# EAGLE design pmg001 (EAGLE 9.6.2)
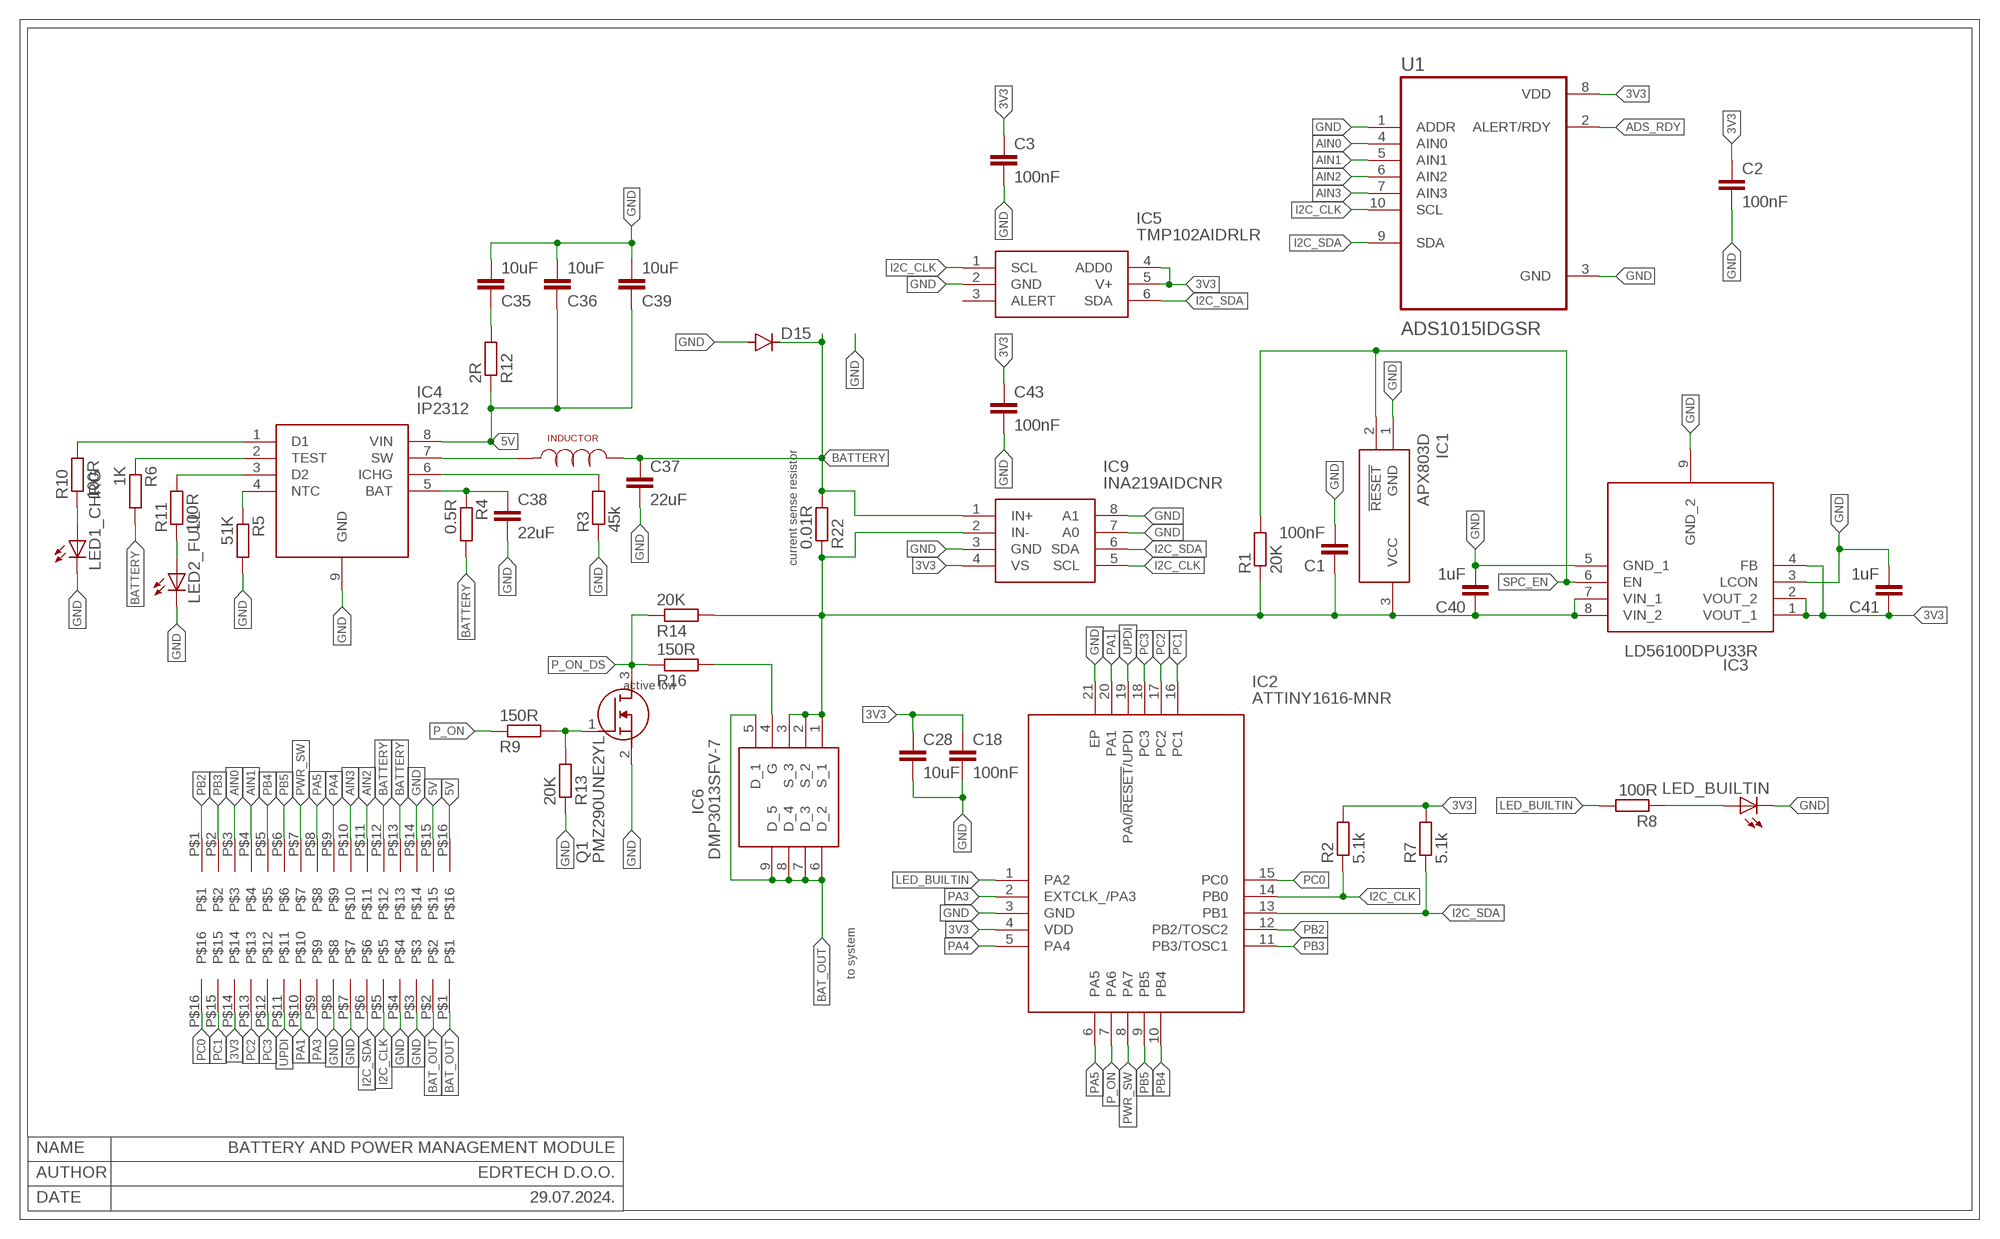
[diagram p0: schematic, sheet 1]

## Parts
C1  100nF  C-EUC0402  [C0402]
C2  100nF  C-EUC0402  [C0402]
C3  100nF  C-EUC0402  [C0402]
C18  100nF  C-EUC0402  [C0402]
C28  10uF  C-EUC0402  [C0402]
C35  10uF  C-EUC0603  [C0603]
C36  10uF  C-EUC0603  [C0603]
C37  22uF  C-EUC0603  [C0603]
C38  22uF  C-EUC0603  [C0603]
C39  10uF  C-EUC0603  [C0603]
C40  1uF  C-EUC0402  [C0402]
C41  1uF  C-EUC0402  [C0402]
C43  100nF  C-EUC0402  [C0402]
D15  DIODE-SOD523  [SOD523]
IC1  APX803D-29SAG-7  [SOT96P240X110-3N]
IC2  ATTINY1616-MNR  [QFN40P300X300X90-21N]
IC3  LD56100DPU30R  [SON40P120X160X50-9N]
IC4  IP2312  [SOIC127P600X165-9N]
IC5  TMP102AIDRLR  [SOTFL50P160X60-6N]
IC6  DMP3013SFV-7  [DMP3036SFV7]
IC9  INA219AIDCNR  [SOP65P280X145-8N]
LED1_CHRG  LEDCHIPLED_0603  [CHIPLED_0603]
LED2_FULL  LEDCHIPLED_0603  [CHIPLED_0603]
LED_BUILTIN  LEDCHIPLED_0603  [CHIPLED_0603]
Q1  PMZ290UNE2YL  [PMZ290UNE2YL]
R1  20K  R-EU_R0402  [R0402]
R2  5.1k  R-EU_R0402  [R0402]
R3  45k  R-EU_R0402  [R0402]
R4  0.5R  R-EU_R0402  [R0402]
R5  51K  R-EU_R0402  [R0402]
R6  1K  R-EU_R0402  [R0402]
R7  5.1k  R-EU_R0402  [R0402]
R8  100R  R-EU_R0402  [R0402]
R9  150R  R-EU_R0402  [R0402]
R10  100R  R-EU_R0402  [R0402]
R11  100R  R-EU_R0402  [R0402]
R12  2R  R-EU_R0402  [R0402]
R13  20K  R-EU_R0402  [R0402]
R14  20K  R-EU_R0402  [R0402]
R16  150R  R-EU_R0402  [R0402]
R22  0.01R  R-EU_R2512  [R2512]
U1  ADS1015IDGSR  [SOP50P490X110-10N]
U$1  1.27_MALE_16P_HEADER  [1.27_MALE_16P_HEADER]
U$2  1.27_MALE_16P_HEADER  [1.27_MALE_16P_HEADER]
U$91  1uH  NRS5040T3R3NMGJ  [NRS5040T3R3NMGJ]

## Nets
3V3: C2.1 C3.1 C18.1 C28.1 C41.1 C43.1 IC2.4(VDD) IC3.1(VOUT_1) IC3.2(VOUT_2) IC3.4(FB) IC5.4(ADD0) IC5.5(V+) IC9.4(VS) R2.2 R7.2 U1.8(VDD) U$2.P$14
5V: C36.1 C39.1 IC4.8(VIN) R12.1 U$1.P$15 U$1.P$16
ADS_RDY: U1.2(ALERT/RDY)
AIN0: U1.4(AIN0) U$1.P$3
AIN1: U1.5(AIN1) U$1.P$4
AIN2: U1.6(AIN2) U$1.P$11
AIN3: U1.7(AIN3) U$1.P$10
BAT_OUT: IC6.5(D_1) IC6.6(D_2) IC6.7(D_3) IC6.8(D_4) IC6.9(D_5) U$2.P$1 U$2.P$2
BATTERY: C37.1 D15.C IC9.1(IN+) R4.2 R6.2 R22.2 U$1.P$12 U$1.P$13 U$91.P$1
BTAP: C1.1 C40.1 IC1.3(VCC) IC3.7(VIN_1) IC3.8(VIN_2) IC6.1(S_1) IC6.2(S_2) IC6.3(S_3) IC9.2(IN-) R1.1 R14.2 R22.1
GND: C1.2 C2.2 C3.2 C18.2 C28.2 C35.2 C36.2 C37.2 C38.2 C39.2 C40.2 C41.2 C43.2 D15.A IC1.1(GND) IC2.3(GND) IC2.21(EP) IC3.3(LCON) IC3.5(GND_1) IC3.9(GND_2) IC4.9(GND) IC5.2(GND) IC9.3(GND) IC9.7(A0) IC9.8(A1) LED1_CHRG.C LED2_FULL.C LED_BUILTIN.C Q1.2(S) R3.1 R5.2 R13.1 U1.1(ADDR) U1.3(GND) U$1.P$14 U$2.P$3 U$2.P$4 U$2.P$7 U$2.P$8
I2C_CLK: IC2.14(PB0) IC5.1(SCL) IC9.5(SCL) R2.1 U1.10(SCL) U$2.P$5
I2C_SDA: IC2.13(PB1) IC5.6(SDA) IC9.6(SDA) R7.1 U1.9(SDA) U$2.P$6
LED_BUILTIN: IC2.1(PA2) R8.2
N$1: Q1.1(G) R9.2 R13.2
N$2: LED_BUILTIN.A R8.1
N$6: IC6.4(G) R16.2
N$8: IC4.6(ICHG) R3.2
N$10: C35.1 R12.2
N$12: LED1_CHRG.A R10.1
N$13: LED2_FULL.A R11.1
N$14: IC4.4(NTC) R5.1
N$15: IC4.2(TEST) R6.1
N$16: IC4.1(D1) R10.2
N$18: IC4.3(D2) R11.2
N$21: C38.1 IC4.5(BAT) R4.1
N$22: IC4.7(SW) U$91.P$2
P_ON: IC2.7(PA6) R9.1
P_ON_DS: Q1.3(D) R14.1 R16.1
PA1: IC2.20(PA1) U$2.P$10
PA3: IC2.2(EXTCLK_/PA3) U$2.P$9
PA4: IC2.5(PA4) U$1.P$9
PA5: IC2.6(PA5) U$1.P$8
PB2: IC2.12(PB2/TOSC2) U$1.P$1
PB3: IC2.11(PB3/TOSC1) U$1.P$2
PB4: IC2.10(PB4) U$1.P$5
PB5: IC2.9(PB5) U$1.P$6
PC0: IC2.15(PC0) U$2.P$16
PC1: IC2.16(PC1) U$2.P$15
PC2: IC2.17(PC2) U$2.P$13
PC3: IC2.18(PC3) U$2.P$12
PWR_SW: IC2.8(PA7) U$1.P$7
SPC_EN: IC1.2(!RESET) IC3.6(EN) R1.2
UPDI: IC2.19(PA0/!RESET!/UPDI) U$2.P$11
Unconnected: IC5.3(ALERT)

## Notes on the sheet
- APX803D
- current sense resistor
- LD56100DPU33R
- active low
- to system
- NAME | BATTERY AND POWER MANAGEMENT MODULE
- AUTHOR | EDRTECH D.O.O.
- DATE | 29.07.2024.

## Library data of the parts
C1-C3 C18 C28 C35-C41 C43 = rcl:C-EU: CAPACITOR, European symbol; SPICEPREFIX: C
D15 = diode:DIODE-: DIODE
IC1 = edrtech_lib:APX803D-29SAG-7: Supervisory Circuits 3-Pin MPU Reset 30uA 2.5V, 3V, 3.3V, 5V Source: Datasheet <https://www.diodes.com/assets/Datasheets/products_inactive_data/APX803-D-Not-Recommended.pdf>; ARROW_PART_NUMBER: APX803D-29SAG-7; ARROW_PRICE-STOCK: https://www.arrow.com/en/products/apx803d-29sag-7/diodes-incorporated; DESCRIPTION: Supervisory Circuits 3-Pin MPU Reset 30uA 2.5V, 3V, 3.3V, 5V; HEIGHT: 1.1mm; MANUFACTURER_NAME: Diodes Incorporated; MANUFACTURER_PART_NUMBER: APX803D-29SAG-7; MOUSER_PART_NUMBER: 621-APX803D-29SAG-7; MOUSER_PRICE-STOCK: http://www.mouser.com/Search/ProductDetail.aspx?qs=j2HO5yQWbRfEn7scG%2fxEEg%3d%3d
IC2 = edrtech_lib:ATTINY1616-MNR: Microchip ATTINY1616-MNR, 8bit AVR Microcontroller, 20MHz, 16 kB Flash, 20-Pin VQFN Source: Datasheet <https://datasheet.datasheetarchive.com/originals/distributors/DKDS41/DSANUWW0026757.pdf>; ARROW_PART_NUMBER: ATTINY1616-MNR; ARROW_PRICE-STOCK: https://www.arrow.com/en/products/attiny1616-mnr/microchip-technology?region=nac; DESCRIPTION: Microchip ATTINY1616-MNR, 8bit AVR Microcontroller, 20MHz, 16 kB Flash, 20-Pin VQFN; HEIGHT: 0.9mm; MANUFACTURER_NAME: Microchip; MANUFACTURER_PART_NUMBER: ATTINY1616-MNR; MOUSER_PART_NUMBER: 556-ATTINY1616MNR; MOUSER_PRICE-STOCK: https://www.mouser.co.uk/ProductDetail/Microchip-Technology/ATTINY1616-MNR?qs=HXFqYaX1Q2yKNpuKQU9qww%3D%3D
IC3 = edrtech_lib:LD56100DPU30R: LDO Voltage Regulators POWER MANAGEMENT Source: Datasheet <https://componentsearchengine.com/Datasheets/1/LD56100DPU30R.pdf>; ARROW_PART_NUMBER: LD56100DPU30R; ARROW_PRICE-STOCK: https://www.arrow.com/en/products/ld56100dpu30r/stmicroelectronics?region=nac; DESCRIPTION: LDO Voltage Regulators POWER MANAGEMENT; HEIGHT: 0.5mm; MANUFACTURER_NAME: STMicroelectronics; MANUFACTURER_PART_NUMBER: LD56100DPU30R; MOUSER_PART_NUMBER: 511-LD56100DPU30R; MOUSER_PRICE-STOCK: https://www.mouser.co.uk/ProductDetail/STMicroelectronics/LD56100DPU30R?qs=rrS6PyfT74cpfJYuxhTQmg%3D%3D
IC4 = IP2312:IP2312: ESOP-8L DC-DC Converters RoHS Source: Datasheet <http://www.injoinic.com/wwwroot/uploads/files/20230913/623558e526750db62e25e32800f94a6b.pdf>; DESCRIPTION: ESOP-8L DC-DC Converters RoHS; HEIGHT: 1.65mm; MANUFACTURER_NAME: INJOINIC; MANUFACTURER_PART_NUMBER: IP2312
IC5 = edrtech_lib:TMP102AIDRLR: 1.4V-Capable Temperature Sensor with I2C/SMBus Interface and Alert Function in SOT-563 Source: Datasheet <http://www.ti.com/lit/gpn/tmp102>; ARROW_PART_NUMBER: TMP102AIDRLR; ARROW_PRICE-STOCK: https://www.arrow.com/en/products/tmp102aidrlr/texas-instruments?region=nac; DESCRIPTION: 1.4V-Capable Temperature Sensor with I2C/SMBus Interface and Alert Function in SOT-563; HEIGHT: 0.6mm; MANUFACTURER_NAME: Texas Instruments; MANUFACTURER_PART_NUMBER: TMP102AIDRLR; MOUSER_PART_NUMBER: 595-TMP102AIDRLR; MOUSER_PRICE-STOCK: https://www.mouser.co.uk/ProductDetail/Texas-Instruments/TMP102AIDRLR?qs=SUwrw6jWmlKK8eMrKfK4LA%3D%3D
IC6 = edrtech_lib:DMP3013SFV-7: Trans MOSFET P-CH 30V 12A 8-Pin PowerDI EP T/R Source: Datasheet <https://www.diodes.com//assets/Datasheets/DMP3013SFV.pdf>; ARROW_PART_NUMBER: DMP3013SFV-7; ARROW_PRICE-STOCK: https://www.arrow.com/en/products/dmp3013sfv-7/diodes-incorporated?region=nac; DESCRIPTION: Trans MOSFET P-CH 30V 12A 8-Pin PowerDI EP T/R; HEIGHT: mm; MANUFACTURER_NAME: Diodes Incorporated; MANUFACTURER_PART_NUMBER: DMP3013SFV-7; MOUSER_PART_NUMBER: 621-DMP3013SFV-7; MOUSER_PRICE-STOCK: https://www.mouser.co.uk/ProductDetail/Diodes-Incorporated/DMP3013SFV-7?qs=W0yvOO0ixfH1hnmiAtL1VQ%3D%3D
IC9 = edrtech_lib:INA219AIDCNR: TEXAS INSTRUMENTS - INA219AIDCNR - CURRENT/POWER MONITOR, SOT-23-8, FULL REEL Source: Datasheet <https://componentsearchengine.com/Datasheets/2/INA219AIDCNR.pdf>; ARROW_PART_NUMBER: INA219AIDCNR; ARROW_PRICE-STOCK: null?region=nac; DESCRIPTION: TEXAS INSTRUMENTS - INA219AIDCNR - CURRENT/POWER MONITOR, SOT-23-8, FULL REEL; HEIGHT: 1.45mm; MANUFACTURER_NAME: Texas Instruments; MANUFACTURER_PART_NUMBER: INA219AIDCNR; MOUSER_PART_NUMBER: 595-INA219AIDCNR; MOUSER_PRICE-STOCK: https://www.mouser.co.uk/ProductDetail/Texas-Instruments/INA219AIDCNR?qs=NNt36bEIu0tiHc879dL2eg%3D%3D
LED1_CHRG LED2_FULL LED_BUILTIN = adafruit:LED: LED OSRAM: - CHIPLED LG R971, LG N971, LY N971, LG Q971, LY Q971, LO R971, LY R971 LH N974, LH R974 LS Q976, LO Q976, LY Q976 LO Q996 - Hyper CHIPLED LW Q18S LB Q993, LB Q99A, LB R99A - SideLED LS A670, LO A670, LY A670, LG A670, LP A670 LB A673, LV A673, LT A673, LW A673 LH A674 LY A675 LS A676, LA A676, LO A676, LY A676, LW A676 LS A679, LY A679, LG A679 - Hyper Micro SIDELED® LS Y876, LA Y876, LO Y876, LY Y876 LT Y87S - SmartLED LW L88C, LW L88S LB L89C, LB L89S, LG L890 LS L89K, LO L89K, LY L89K LS L896, LA L896, LO L896, LY L896 - TOPLED LS T670, LO T670, LY T670, LG T670, LP T670 LSG T670, LSP T670, LSY T670, LOP T670, LYG T670 LG T671, LOG T671, LSG T671 LB T673, LV T673, LT T673, LW T673 LH T674 LS T676, LA T676, LO T676, LY T676, LB T676, LH T676, LSB T676, LW T676 LB T67C, LV T67C, LT T67C, LS T67K, LO T67K, LY T67K, LW E67C LS E67B, LA E67B, LO E67B, LY E67B, LB E67C, LV E67C, LT E67C LW T67C LS T679, LY T679, LG T679 LS T770, LO T770, LY T770, LG T770, LP T770 LB T773, LV T773, LT T773, LW T773 LH T774 LS E675, LA E675, LY E675, LS T675 LS T776, LA T776, LO T776, LY T776, LB T776 LHGB T686 LT T68C, LB T68C - Hyper Mini TOPLED® LB M676 - Mini TOPLED Santana® LG M470 LS M47K, LO M47K, LY M47K Source: http://www.osram.convergy.de/
Q1 = edrtech_lib:PMZ290UNE2YL: NEXPERIA - PMZ290UNE2YL - MOSFET, N-CH, 20V, 1.2A, SOT883-3 Source: Datasheet <https://assets.nexperia.com/documents/data-sheet/PMZ290UNE2.pdf>; ARROW_PART_NUMBER: PMZ290UNE2YL; ARROW_PRICE-STOCK: https://www.arrow.com/en/products/pmz290une2yl/nexperia?region=nac; DESCRIPTION: NEXPERIA - PMZ290UNE2YL - MOSFET, N-CH, 20V, 1.2A, SOT883-3; HEIGHT: 0.5mm; MANUFACTURER_NAME: Nexperia; MANUFACTURER_PART_NUMBER: PMZ290UNE2YL; MOUSER_PART_NUMBER: 771-PMZ290UNE2YL; MOUSER_PRICE-STOCK: https://www.mouser.co.uk/ProductDetail/Nexperia/PMZ290UNE2YL?qs=d7b8vw%252BBfo36oSq9BwEp0w%3D%3D
R1-R14 R16 R22 = rcl:R-EU_: RESISTOR, European symbol; SPICEPREFIX: R
U1 = edrtech_lib:ADS1015IDGSR: Check availability <https://pricing.snapeda.com/parts/ADS1015IDGSR/Texas%20Instruments/view-part?ref=eda>; AVAILABILITY: In Stock; CHECK_PRICES: https://www.snapeda.com/parts/ADS1015IDGSR/Texas+Instruments/view-part/?ref=eda; DESCRIPTION: 12-bit, 3.3-kSPS, 4-channel, delta-sigma ADC with PGA, oscillator, VREF, comparator and I2C; MF: Texas Instruments; MP: ADS1015IDGSR; PACKAGE: VSSOP-10 Texas Instruments; PRICE: None; PURCHASE-URL: https://www.snapeda.com/api/url_track_click_mouser/?unipart_id=449361&manufacturer=Texas Instruments&part_name=ADS1015IDGSR&search_term=ads1015; SNAPEDA_LINK: https://www.snapeda.com/parts/ADS1015IDGSR/Texas+Instruments/view-part/?ref=snap
U$1 U$2 = edrtech_lib:1.27_MALE_16P_HEADER
U$91 = edrtech_lib:NRS5040T3R3NMGJ

## Net classes
0 default: width 0.203 mm

## Board
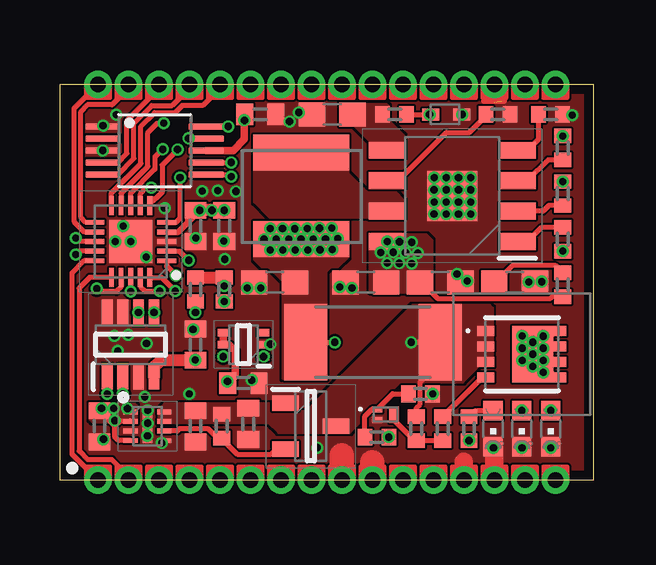
[diagram p1: board, top side]
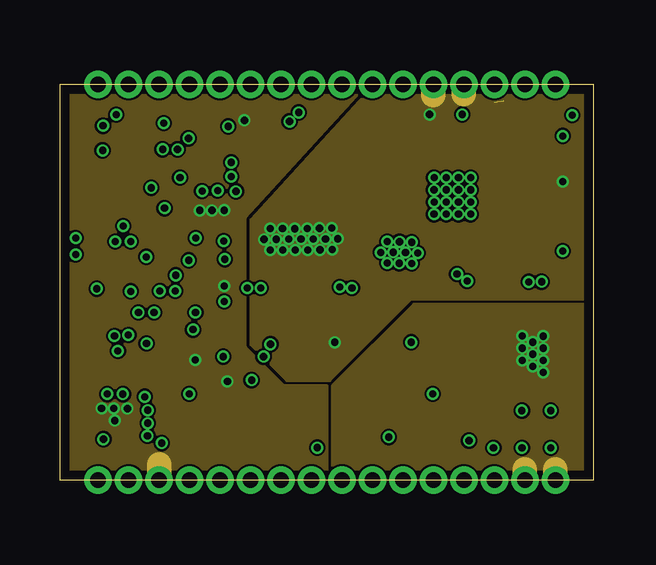
[diagram p2: board, inner layer Route2]
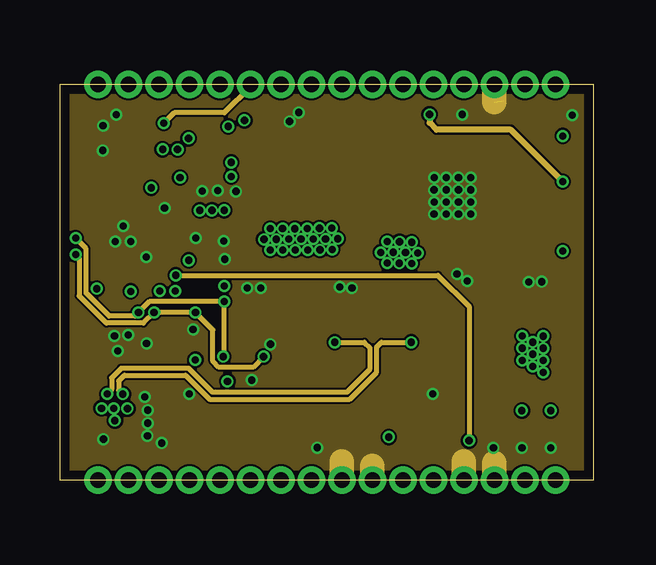
[diagram p3: board, inner layer Route3]
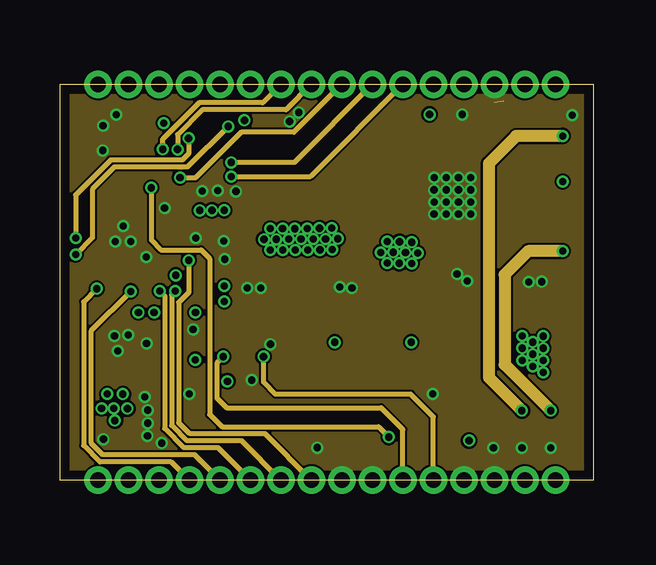
[diagram p4: board, inner layer Route14]
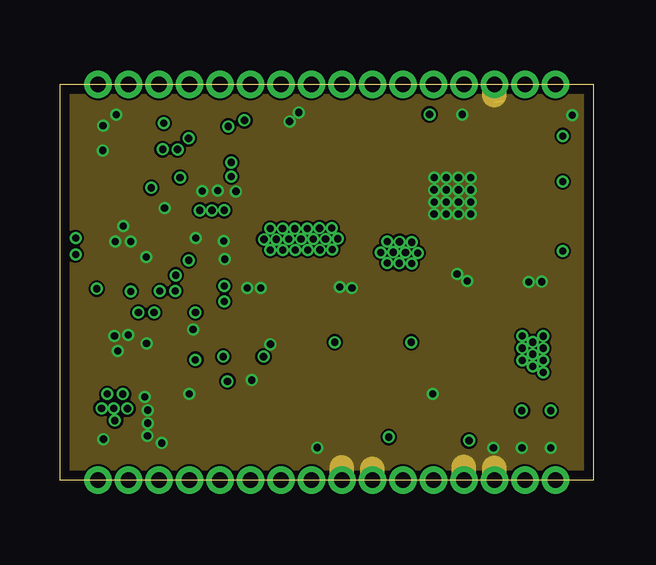
[diagram p5: board, inner layer Route15]
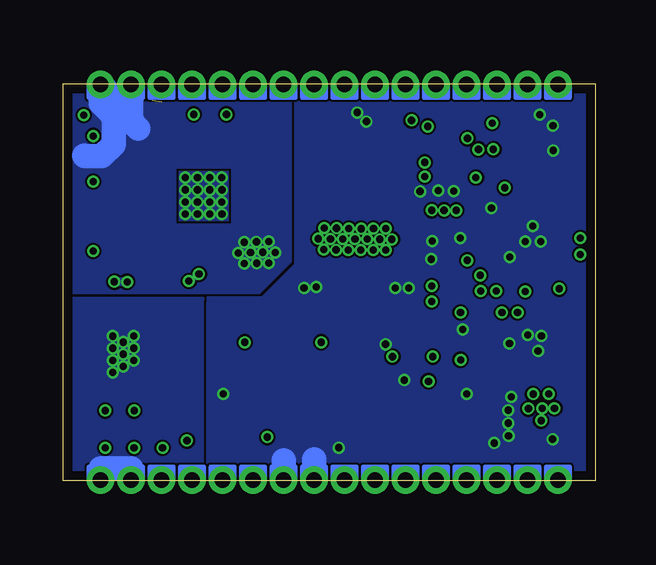
[diagram p6: board, bottom side, seen from below]

Size 22.23 x 16.51 mm. Coordinates in mm from the lower left corner, seen from the top.
Outline: 0,0 0,16.51 22.23,16.51 22.23,0 0,0
Copper layers (1+2*3+14*15+16): Top 0.035mm / dielectric 0.0994mm / Route2 0.0152mm / dielectric 0.55mm / Route3 0.0152mm / dielectric 0.1088mm / Route14 0.0152mm / dielectric 0.55mm / Route15 0.0152mm / dielectric 0.0994mm / Bottom 0.035mm
Design rules "jlcpcb-6layers_edrtech_minspec *": minimum track width 3.5mil, minimum drill 0.3mm, track to track 3.5mil, track to pad 3.5mil, pad to pad 3.5mil, via to via 3.5mil, smd to smd 0mil, copper to edge 0.4mm, drill to drill 6mil, minimum pad ring 0.25mm, minimum via ring 0.1mm, stop-mask expansion 2mil, vias tented up to drill 25mil, thermal gap 5mil

### Footprints (pad centres in the part's own frame; a part is rotated, then mirrored left to right if it is on the bottom)
C0402 = smd 0.7 x 0.9: 1 -0.65,0; 2 0.65,0
C0603 = smd 1.1 x 1: 1 -0.85,0; 2 0.85,0
SOD523 = smd 0.7 x 0.5: A 0.7,0; C -0.6,0
SOT96P240X110-3N = smd 1.1 x 0.65: 1 -1.05,0.96; 2 -1.05,-0.96; 3 1.05,0
QFN40P300X300X90-21N = smd 0.8 x 0.2: 1 -1.5,0.8; 2 -1.5,0.4; 3 -1.5,0; 4 -1.5,-0.4; 5 -1.5,-0.8; 11 1.5,-0.8; 12 1.5,-0.4; 13 1.5,0; 14 1.5,0.4; 15 1.5,0.8 | smd 0.2 x 0.8: 6 -0.8,-1.5; 7 -0.4,-1.5; 8 0,-1.5; 9 0.4,-1.5; 10 0.8,-1.5; 16 0.8,1.5; 17 0.4,1.5; 18 0,1.5; 19 -0.4,1.5; 20 -0.8,1.5 | smd 1.8 x 1.8: 21 0,0
SON40P120X160X50-9N = smd 0.6 x 0.2: 1 -0.7,0.6; 2 -0.7,0.2; 3 -0.7,-0.2; 4 -0.7,-0.6; 5 0.7,-0.6; 6 0.7,-0.2; 7 0.7,0.2; 8 0.7,0.6 | smd 0.4 x 1.4: 9 0,0
SOIC127P600X165-9N = smd 1.525 x 0.7: 1 -2.712,1.905; 2 -2.712,0.635; 3 -2.712,-0.635; 4 -2.712,-1.905; 5 2.712,-1.905; 6 2.712,-0.635; 7 2.712,0.635; 8 2.712,1.905 | smd 2.09 x 2.09: 9 0,0
SOTFL50P160X60-6N = smd 0.475 x 0.3: 1 -0.838,0.5; 2 -0.838,0; 3 -0.838,-0.5; 4 0.838,-0.5; 5 0.838,0; 6 0.838,0.5
DMP3036SFV7 = smd 0.42 x 0.7: 1 -0.975,-1.5; 2 -0.325,-1.5; 3 0.325,-1.5; 4 0.975,-1.5 | smd 0.42 x 0.54: 5 0.975,1.58; 6 0.325,1.58; 7 -0.325,1.58; 8 -0.975,1.58 | smd 2.37 x 1.71: 9 0,0.455
SOP65P280X145-8N = smd 1.075 x 0.45: 1 -1.338,0.975; 2 -1.338,0.325; 3 -1.338,-0.325; 4 -1.338,-0.975; 5 1.338,-0.975; 6 1.338,-0.325; 7 1.338,0.325; 8 1.338,0.975
CHIPLED_0603 = smd 0.8 x 0.8: A 0,-0.75; C 0,0.75
PMZ290UNE2YL = smd 0.4 x 0.25: 1 -0.35,0.226; 2 -0.35,-0.225 | smd 0.4 x 0.7: 3 0.35,0.001
R0402 = smd 0.6 x 0.7: 1 -0.5,0; 2 0.5,0
R2512 = smd 1.8 x 3.2: 1 -2.8,0; 2 2.8,0
SOP50P490X110-10N = smd 1.47 x 0.28: 1 -2.15,1; 2 -2.15,0.5; 3 -2.15,0; 4 -2.15,-0.5; 5 -2.15,-1; 6 2.15,-1; 7 2.15,-0.5; 8 2.15,0; 9 2.15,0.5; 10 2.15,1
1.27_MALE_16P_HEADER = drill 0.65 pad 1.15: P$1 -9.525,0; P$2 -8.255,0; P$3 -6.985,0; P$4 -5.715,0; P$5 -4.445,0; P$6 -3.175,0; P$7 -1.905,0; P$8 -0.635,0; P$9 0.635,0; P$10 1.905,0; P$11 3.175,0; P$12 4.445,0; P$13 5.715,0; P$14 6.985,0; P$15 8.255,0; P$16 9.525,0
NRS5040T3R3NMGJ = smd 1.5 x 4: P$1 -1.8,0; P$2 1.8,0

### Placement (x,y rotation side)
C1  7.84,2.35 270 top
C2  8.34,15.25 0 top
C3  7.64,4.05 0 top
C18  5.64,10.61 270 top
C28  6.84,10.61 270 top
C35  18.94,8.25 0 top
C36  15.84,8.25 0 top
C37  8.94,8.25 180 top
C38  11.34,15.25 180 top
C39  12.74,8.25 180 top
C40  5.64,2.25 270 top
C41  1.64,2.25 270 top
C43  5.64,5.65 90 top
D15  16.04,15.25 0 top
IC1  10.44,2.25 0 top
IC2  2.94,9.95 180 top
IC3  3.64,2.25 0 top
IC4  16.34,11.85 180 top
IC5  7.64,5.65 180 top
IC6  19.24,5.25 270 top
IC9  2.94,5.65 90 top
LED1_CHRG  20.44,2.15 180 top
LED2_FULL  19.24,2.15 180 top
LED_BUILTIN  18.04,2.15 180 top
Q1  13.57,2.74 0 top
R1  6.74,2.25 270 top
R2  5.64,7.95 90 top
R3  18.24,15.25 180 top
R4  13.94,15.25 0 top
R5  20.44,15.25 0 top
R6  20.94,11.95 90 top
R7  6.84,7.95 90 top
R8  17.04,2.15 270 top
R9  13.2,1.8 180 top
R10  20.94,10.05 90 top
R11  20.94,13.85 270 top
R12  20.94,8.15 90 top
R13  15.02,3.6 180 top
R14  14.84,2.15 90 top
R16  15.94,2.15 90 top
R22  13.04,5.75 180 top
U1  3.94,13.75 0 top
U$1  11.11,16.51 0 top
U$2  11.11,0 180 top
U$91  10.04,11.85 90 top

### Tracks (layer width: path | path; a pad name or v marks a point on that pad's centre or on a via)
3V3  (via drill 0.3)
  Top 0.203: IC3.4 2.44,1.65 2.29,1.81 2.29,2.26 | C41.1 2.29,2.26 | 2.29,2.26 2.5,2.48 2.92,2.48 IC3.2
  Top 0.254: IC2.4 4.93,10.35 5.32,10.74 | 5.32,10.74 5.32,11.05 5.53,11.26 C18.1 5.64,11.06 5.32,10.74 | C2.1 v7.69,15.02 v7.68,15.01 | C43.1 v5.64,5.02
  Top 0.305: U1.8 7.22,13.75 7.68,14.22 v7.68,15.01 | IC5.4 IC5.5 7.04,5.64 7.3,5.39 7.3,4.36 C3.1 7,4.11 v6.98,4.12
  Top 0.508: C28.1 C18.1 | IC9.4 3.92,4.73 4.21,5.02 v5.64,5.02 | R2.2 R7.2 v6.84,8.1
  Route2 1.016: U$2.P$14 4.13,0.66
  other vias: 6.84,11.26 6.33,11.26 5.82,11.25 1.73,3 2.24,3 2.81,2.99 2.29,2.49
  pour Route2 (no thermals): 11.13,0 11.13,3.94 9.35,3.94 7.73,5.56 7.73,10.94 12.8,16.51 0.4,16.51 0.4,0
  pour Top (no thermals): 1.26,3.19 3.11,3.19 3.18,3.12 3.18,2.42 1.37,2.42 1.26,2.53
5V  (via drill 0.3)
  Top 0.203: R12.1 20.51,7.65 20.42,7.56 15.75,7.56 15.16,8.15 15.09,8.15 C36.1
  Bottom 1.016: U$1.P$15 19.37,14.97 19.07,14.66 | 20.1,14.73 19.88,14.96 20.64,15.72 U$1.P$16 20.15,16.02 19.54,16.02 | 20.1,14.73 20.1,14 20.59,13.51 21.3,13.51 21.32,13.53 | 20,15.14 20.1,15.04 20.1,14.73
  other vias: 13.63,9.95 14.15,9.94 14.66,9.93 13.88,9.51 14.39,9.49 14.91,9.48 13.37,9.5 13.63,9.06 14.14,9.05 14.65,9.04
  pour Top (no thermals): 15.48,7.82 13.02,7.82 12.94,7.9 12.94,10.24 15.26,10.24 15.48,10.02
  pour Bottom (rank 2, no thermals): 12.71,16.5 21.82,16.5 21.82,7.82 14.02,7.82 12.71,9.13
AIN0
  Top 0.203: U1.4 2.42,13.25 2.79,13.62 2.79,15 4.13,16.34 U$1.P$3
AIN1
  Top 0.203: U1.5 2.42,12.75 3.08,13.41 3.08,14.88 3.82,15.62 4.67,15.62 5.4,16.34 U$1.P$4
AIN2  (via drill 0.3 pad 0.45)
  Top 0.203: U1.6 7.05,12.75 v7.13,12.66
  Route14 0.203: v7.13,12.66 10.44,12.66 U$1.P$11
AIN3  (via drill 0.3 pad 0.45)
  Top 0.203: U1.7 v7.14,13.25
  Route14 0.203: U$1.P$10 9.76,13.25 v7.14,13.25
BAT_OUT  (via drill 0.3)
  Top 0.203: IC6.8 20.67,6.23 IC6.9 | IC6.7 20.02,5.58 IC6.9 | IC6.6 20.02,4.93 IC6.9 | IC6.5 20.67,4.28 IC6.9
  Route2 1.016: U$2.P$2 19.37,0.46 | U$2.P$1 20.64,0.45
  Bottom 1.016: U$2.P$2 19.37,0.49 | U$2.P$1 20.64,0.5 19.57,0.5
  other vias: 19.7,5.25 19.7,5.76 19.7,4.75 19.26,5 19.26,5.51 19.26,6.01 20.14,5.5 20.14,6.01 20.14,5 20.13,4.49
  pour Route2 (no thermals): 21.82,7.34 14.73,7.34 11.34,3.95 11.34,0 21.82,0
  pour Bottom (no thermals): 21.82,0 21.82,7.6 16.39,7.6 16.4,7.42 16.4,0
BATTERY  (via drill 0.3, 0.3 pad 0.45)
  Top 0.203: R22.2 v11.45,5.75 | IC9.1 v1.97,3.59 | R4.2 v15.4,15.25 D15.C
  Route2 1.016: U$1.P$12 15.56,16.05 | U$1.P$13 16.83,16.11
  Route3 0.203: v11.45,5.75 12.68,5.75 12.9,5.54 12.9,4.62 11.95,3.67 6.36,3.67 5.36,4.67 2.55,4.67 2.15,4.27 2.15,3.78 v1.97,3.59
  Route3 0.254: R6.2 18.79,14.61 15.69,14.61 15.4,14.9 v15.4,15.25
  other vias: 20.94,12.45 10.04,10.05 9.53,10.05 9.02,10.04 8.5,10.04 10.55,10.05 11.06,10.06 11.57,10.07 8.76,10.49 9.27,10.49 9.79,10.49 10.3,10.49 10.81,10.51 11.32,10.51 8.76,9.6 9.29,9.6 9.8,9.6 10.32,9.6 10.83,9.61 11.34,9.61
  pour Route2 (no thermals): 21.82,16.51 13.11,16.51 7.94,10.85 7.94,5.65 9.44,4.15 11.24,4.15 14.64,7.55 21.82,7.55
  pour Top (no thermals): 9.31,4.22 9.31,8.28 8.72,8.87 8.43,8.87 8.11,9.19 8.11,10.74 11.98,10.74 11.98,9.29 11.56,8.87 11.27,8.87 11.08,8.68 11.08,4.22
BTAP  (via drill 0.3 pad 0.45)
  Top 0.203: v14.64,5.75 R22.1 15.85,4.92 15.01,4.09 15.01,3.17 14.85,3.01 R14.2 | IC9.2 v2.62,3.59
  Route3 0.203: v2.62,3.59 2.45,3.76 2.45,4.14 2.68,4.38 5.24,4.38 6.23,3.38 12.07,3.38 13.19,4.5 13.19,5.55 13.39,5.75 v14.64,5.75
  pour Top (no thermals): 8.81,3.19 4.36,3.19 4.11,2.93 4.11,2.42 8.68,2.42 9.11,1.99 12.08,1.99 14.18,4.09 16.78,4.09 17.47,4.78 18.03,4.78 18.03,7.17 17.91,7.29 14.68,7.29 10.24,2.85 9.14,2.85
GND  (via drill 0.3)  (1 unrouted)
  Top 0.254: 17.67,15.82 18.5,15.82
  Top 0.762: U$2.P$4 16.83,0.77 | U$2.P$3 18.1,1.31 v18.06,1.35
  Top 1.016: U$2.P$7 13.02,0.74 | U$2.P$8 11.75,1.05
  Route3 1.016: U$2.P$8 11.75,0.78 | U$2.P$4 16.83,0.8 | U$2.P$3 18.1,0.73 | U$1.P$14 18.1,15.77 | U$2.P$7 13.02,0.6
  Route15 1.016: U$2.P$8 11.75,0.54 | U$2.P$7 13.02,0.47 | U$2.P$4 16.83,0.56 | U$2.P$3 18.1,0.51 | U$1.P$14 18.1,16.07
  Bottom 1.016: U$2.P$7 13.02,0.82 | U$2.P$8 11.75,0.88
  other vias: 2.94,9.95 2.3,9.95 2.64,10.6 3.59,9.31 5.66,10.1 6.82,9.98 6.86,9.21 1.78,13.75 1.79,14.78 9.56,14.96 9.95,15.34 16.76,15.25 21.34,15.23 19.54,8.27 20.07,8.28 16.96,8.3 16.55,8.6 11.66,8.06 12.17,8.01 8.37,8.02 7.81,8.02 8.77,5.67 5.55,6.28 2.27,6.02 2.85,6.06 3.64,1.85 3.65,2.38 3.65,2.92 3.53,3.48 1.81,1.71 4.24,1.55 7.98,4.17 19.25,1.35 20.45,1.35 5.92,12.06 6.57,12.08 7.33,12.05 4.36,11.34 2.35,15.25 3.61,5.7 2.41,5.39 5.39,3.6 10.72,1.36 17.11,12.62 16.6,12.62 16.1,12.62 15.58,12.11 16.09,12.11 16.6,12.11 17.11,11.6 16.6,11.6 16.1,11.6 15.58,11.09 16.09,11.09 16.6,11.09 17.11,11.09 17.11,12.11 15.59,12.62 15.59,11.6 15.54,3.59
  pour Top (rank 6, no thermals): 0.4,0 21.82,0 21.82,16.51 0.4,16.51
  pour Bottom (rank 6, no thermals): 0.4,0 21.82,0 21.82,16.51 0.4,16.51
  pour Route14 (no thermals): 0.4,0 0.4,16.51 21.82,16.51 21.82,0
  pour Route15 (no thermals): 0.4,0 0.4,16.51 21.82,16.51 21.82,0
  pour Bottom (rank 6, no thermals): 0.4,0 0.4,16.51 21.82,16.51 21.82,0
  pour Route3 (no thermals): 0.4,0 0.4,16.51 21.82,16.51 21.82,0
  pour Bottom (no thermals): 15.3,12.9 15.3,10.81 17.39,10.81 17.39,12.9
I2C_CLK  (via drill 0.3 pad 0.45)
  Top 0.203: IC2.14 0.79,9.55 v0.65,9.42 | U1.10 v7.01,14.75 | R2.1 v5.64,6.99
  Route3 0.203: v0.65,9.42 0.8,9.27 0.8,7.68 1.93,6.55 3.48,6.55 IC9.5 v5.64,6.99 6.37,6.27 6.37,4.97 6.62,4.71 8.04,4.71 IC5.1
  Route14 0.203: v7.01,14.75 5.31,13.06 2.27,13.06 1.35,12.14 1.35,10.12 v0.65,9.42 | IC5.1 8.48,4.09 8.99,3.59 14.62,3.59 15.56,2.65 U$2.P$5
  other vias: 3.92,6.99 8.48,5.15
I2C_SDA  (via drill 0.3 pad 0.45)
  Top 0.203: IC2.13 0.79,9.95 v0.65,10.1 | U1.9 v5.36,14.26
  Route3 0.203: v0.65,10.1 1.09,9.65 1.09,7.8 2.04,6.85 3.12,6.85 IC9.6 3.73,7.45 R7.1 6.84,5.19 IC5.6
  Route14 0.203: v5.36,14.26 5.36,13.61 5.1,13.35 2.11,13.35 0.65,11.89 v0.65,10.1 | IC5.6 6.54,4.88 6.54,3.43 6.95,3.02 13.38,3.02 14.29,2.11 U$2.P$6
  other vias: 3.27,6.99 6.84,7.45 6.81,5.15
LED_BUILTIN  (via drill 0.3 pad 0.45)
  Top 0.203: IC2.1 4.44,8.93 v4.83,8.54
  Route3 0.203: v4.83,8.54 15.75,8.54 17.04,7.25 R8.2
  other vias: 17.04,1.65
N$1
  Top 0.203: R9.2 12.7,2.67 13,2.96 Q1.1 13.86,3.6 R13.2
N$2
  Top 0.203: R8.1 17.07,2.65 17.32,2.9 LED_BUILTIN.A
N$6
  Top 0.203: R16.2 16.43,3.14 16.45,3.14 17.59,4.28 IC6.4
N$8
  Top 0.203: IC4.6 14.08,12.49 16.1,14.5 17.06,14.5 17.74,15.19 R3.2
N$10
  Top 0.203: R12.2 20.65,8.94 18.84,8.94 18.15,8.25 C35.1
N$12  (via drill 0.3 pad 0.45)
  Route14 0.508: R10.1 19.51,9.55 18.53,8.57 18.53,4.82 LED1_CHRG.A
  other vias: 20.44,2.9 20.94,9.55
N$13  (via drill 0.3 pad 0.45)
  Route14 0.508: R11.1 19.01,14.35 17.87,13.21 17.87,4.28 LED2_FULL.A
  other vias: 20.94,14.35 19.24,2.9
N$14
  Top 0.203: IC4.4 19.49,13.76 19.95,14.22 R5.1
N$15
  Top 0.203: R6.1 20.37,11.45 20.14,11.22 IC4.2
N$16
  Top 0.203: IC4.1 19.47,9.95 20.08,10.55 R10.2
N$18
  Top 0.203: R11.2 20.34,13.35 19.48,12.49 IC4.3
N$21
  pour Top (no thermals): 11.71,15.69 13.58,15.69 13.68,15.59 13.68,15.02 14.33,14.37 14.33,13.47 12.94,13.47 12.94,14.1 12.23,14.82 11.71,14.82
N$22
  pour Top (no thermals): 14.33,10.95 8.75,10.95 8.11,11.59 8.11,14.34 11.98,14.34 11.98,12.81 12.74,12.05 13.94,12.05 14.33,11.67
P_ON  (via drill 0.3 pad 0.4, 0.3 pad 0.45)
  Top 0.203: IC2.7 3.35,11.94 3.6,12.19 v3.81,12.19
  Route14 0.203: v3.81,12.19 3.81,10.01 4.21,9.61 5.88,9.61 6.24,9.25 6.24,2.74 6.75,2.23 13.27,2.23 R9.1
  other vias: 13.7,1.8
P_ON_DS
  Top 0.203: R16.1 R14.1 14.77,1.65 13.92,2.5 Q1.3
PA1  (via drill 0.3 pad 0.45)
  Top 0.203: IC2.20 4.24,8.45 v4.8,7.89
  Route14 0.203: v4.8,7.89 4.65,7.74 4.65,2.28 5.29,1.64 7.57,1.64 U$2.P$10
PA3  (via drill 0.3 pad 0.45)
  Top 0.203: IC2.2 4.98,9.55 v5.37,9.17
  Route14 0.203: v5.37,9.17 5.37,7.83 4.94,7.41 4.94,2.4 5.41,1.93 8.54,1.93 U$2.P$9
PA4  (via drill 0.3 pad 0.45)
  Top 0.203: IC2.5 4.83,10.75 5,10.93 v5,12.62
  Route14 0.203: v5,12.62 5.65,12.62 7.54,14.51 9.75,14.51 U$1.P$9
PA5  (via drill 0.3 pad 0.45)
  Top 0.203: v4.9,13.79 4.25,13.15 4.25,12.02 3.99,11.75 | 3.99,11.75 3.78,11.75 3.74,11.71 3.74,11.58 | IC2.6 3.74,11.51 3.99,11.75
  Route14 0.203: v4.9,13.79 4.9,14.42 5.93,15.45 9.42,15.45 U$1.P$8
PB2
  Top 0.203: IC2.12 1.01,10.35 0.58,10.79 0.58,15.5 U$1.P$1
PB3
  Top 0.203: IC2.11 1.08,10.75 0.87,10.97 0.87,15.38 1.14,15.65 2.17,15.65 2.86,16.34 U$1.P$2
PB4
  Top 0.203: IC2.10 2.14,11.98 3.37,13.21 3.37,14.76 3.94,15.33 4.79,15.33 5.09,15.62 5.94,15.62 6.67,16.34 U$1.P$5
PB5  (via drill 0.3)
  Top 0.203: IC2.9 2.54,11.97 3.66,13.09 3.66,14.5 4.05,14.89 v4.32,14.89
  Route3 0.203: v4.32,14.89 4.76,15.33 6.85,15.33 7.94,16.41 U$1.P$6
PC0
  Top 0.203: IC2.15 1.01,9.15 0.5,8.64 0.5,1.09 U$2.P$16
PC1
  Top 0.203: IC2.16 1.23,8.45 0.79,8.02 0.79,1.21 1.15,0.86 2.17,0.86 2.86,0.17 U$2.P$15
PC2  (via drill 0.3 pad 0.45)
  Top 0.203: IC2.17 2.54,8.06 2.35,7.86 1.65,7.86 v1.53,7.99
  Route14 0.203: v1.53,7.99 0.99,7.44 0.99,1.45 1.67,0.77 4.63,0.77 U$2.P$13
PC3  (via drill 0.3 pad 0.45)
  Top 0.203: IC2.18 v2.94,7.88
  Route14 0.203: v2.94,7.88 1.29,6.22 1.29,1.56 1.79,1.06 5.61,1.06 U$2.P$12
PWR_SW  (via drill 0.3 pad 0.45)
  Top 0.203: IC2.8 2.94,11.95 3.96,12.97 3.96,13.48 v4.28,13.8
  Route14 0.203: v4.28,13.8 4.28,14.22 5.8,15.74 8.44,15.74 U$1.P$7
SPC_EN
  Top 0.203: IC1.2 9,1.29 8.77,1.06 7.41,1.06 6.75,1.73 R1.2 6.56,1.75 6.17,2.14 4.98,2.14 4.89,2.05 IC3.6
UPDI  (via drill 0.3 pad 0.45)
  Top 0.203: IC2.19 3.35,8.09 3.57,7.86 4.13,7.86 v4.16,7.89
  Route14 0.203: v4.16,7.89 4.36,7.69 4.36,2.15 5.16,1.35 6.59,1.35 U$2.P$11